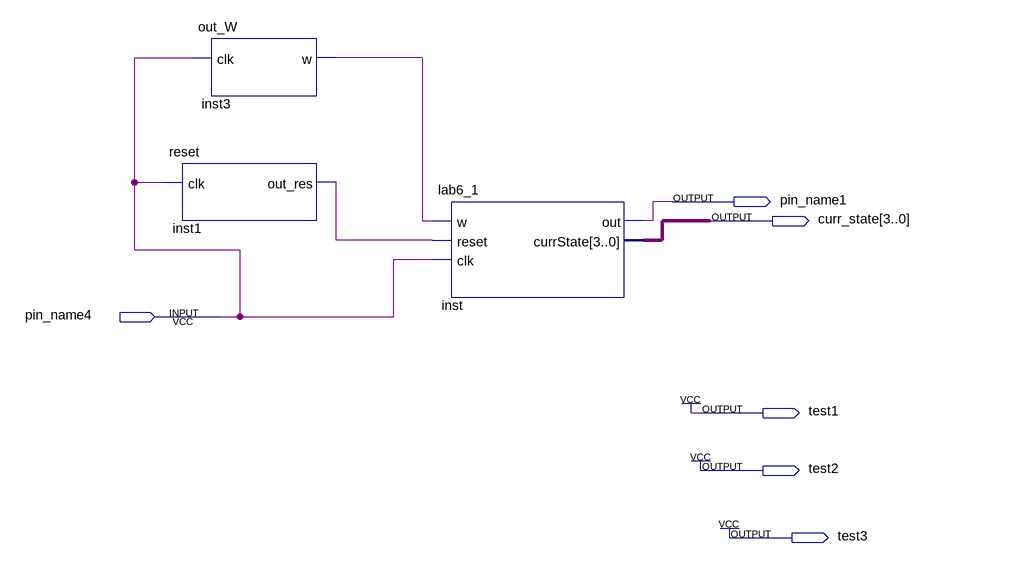
[diagram p0: schematic sheet]
// Quartus schematic Block1.bdf as structural Verilog: 3 symbols, 6 pins
module Block1 (
  input  pin_name4,
  output pin_name1,
  output [3:0] curr_state,
  output test1,
  output test2,
  output test3
);

  wire inst1_out_res, inst3_w;

  reset inst1 (.clk(pin_name4), .out_res(inst1_out_res));
  out_W inst3 (.clk(pin_name4), .w(inst3_w));
  lab6_1 inst (.w(inst3_w), .reset(inst1_out_res), .clk(pin_name4), .out(pin_name1), .currState(curr_state));

  assign test1 = 1'b1;
  assign test2 = 1'b1;
  assign test3 = 1'b1;
endmodule
